# Altium schematic sheet MCU.SchDoc: MCU
size A3; Date: April '16; Organization: Fachhochschule Aachen; Address1: Fachbereich Elektrotechnik und Informationstechnik; Address2: Eupenerstraße 70; Address3: 52066 Aachen; DocumentNumber: 1; Revision: 01.00; SheetNumber: 1; SheetTotal: 2; ModifiedDate: -> Datum
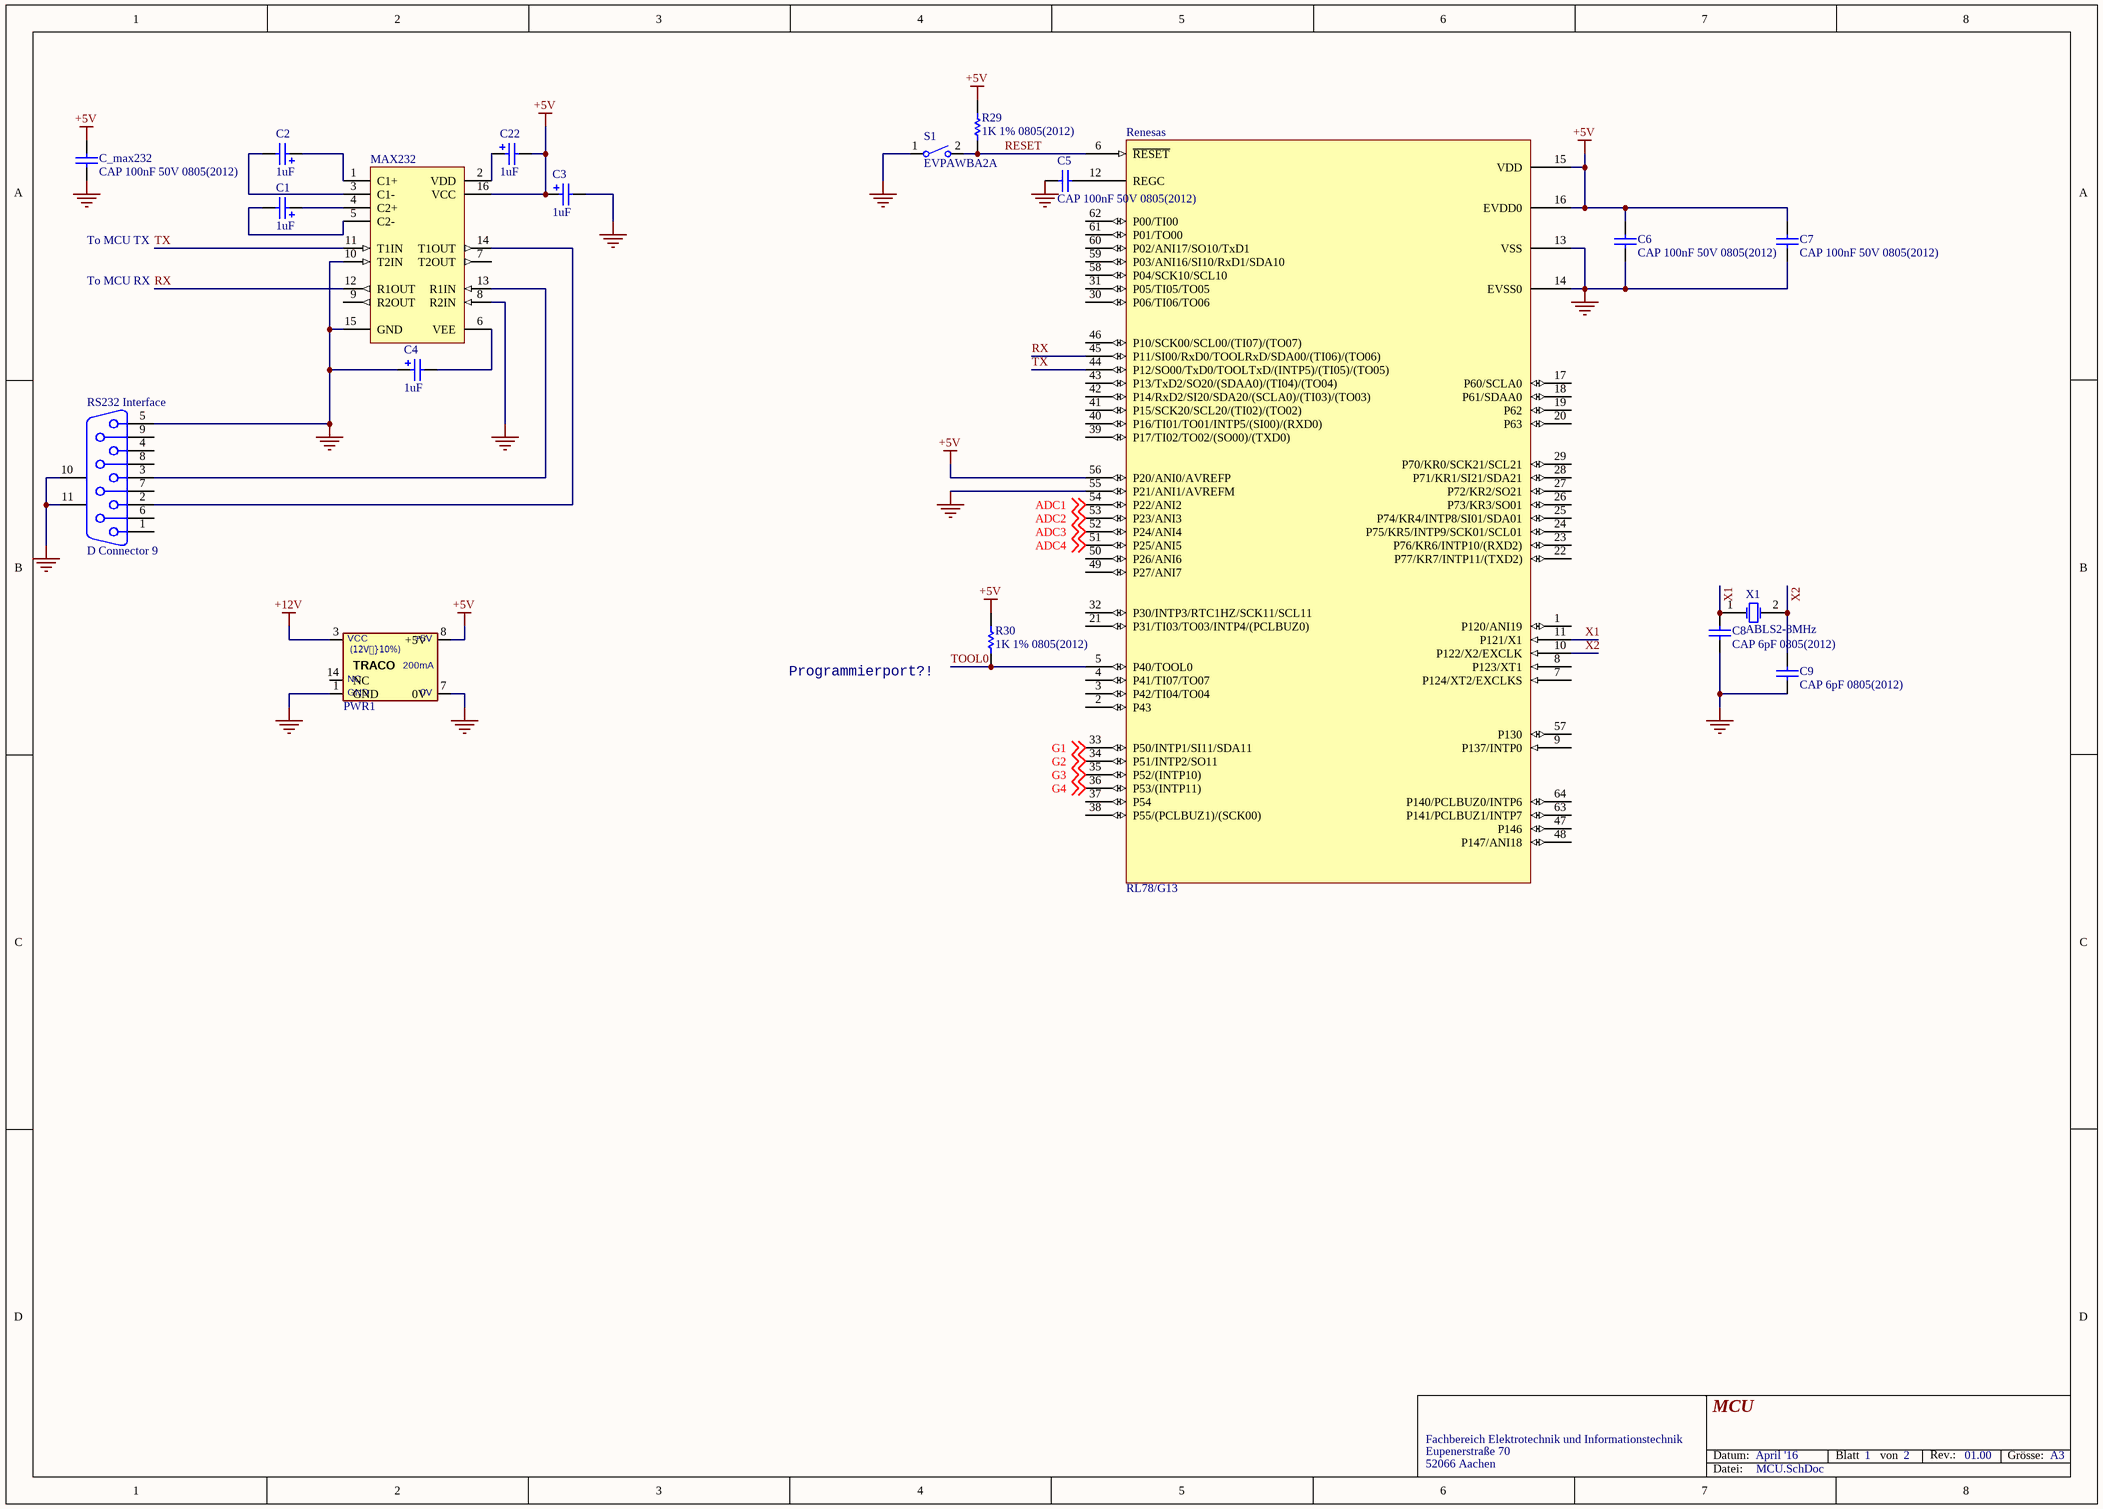
[diagram p0: MCU.SchDoc]

## Parts
C1  value 1uF  [CC2012-0805]  (hidden comment: Cap Pol3)
C2  value 1uF  [CC2012-0805]  (hidden comment: Cap Pol3)
C3  value 1uF  [CC2012-0805]  (hidden comment: Cap Pol3)
C4  value 1uF  [CC2012-0805]  (hidden comment: Cap Pol3)
C5  CAP 100nF 50V 0805(2012)  [CAPC0805(2012)145_M]
C6  CAP 100nF 50V 0805(2012)  [CAPC0805(2012)145_M]
C7  CAP 100nF 50V 0805(2012)  [CAPC0805(2012)145_M]
C8  CAP 6pF 0805(2012)  [CAPC0805(2012)145_M]
C9  CAP 6pF 0805(2012)  [CAPC0805(2012)145_M]
C22  value 1uF  [CC2012-0805]  (hidden comment: Cap Pol3)
C_max232  CAP 100nF 50V 0805(2012)  [CAPC0805(2012)145_M]
MAX232  MAX232CSE  [NSO16]  (value not drawn)
PWR1  TES1-1211  [TES14]  (value not drawn)
R29  1K 1% 0805(2012)  [RESC0805(2012)_M]
R30  1K 1% 0805(2012)  [RESC0805(2012)_M]
Renesas  RL78/G13  [R5F100LEAFA - duplicate]
RS232_Interface  D Connector 9  [DSUB1.385-2H9]
S1  EVPAWBA2A  [PNSC-EVPAW_V]
X1  ABLS2-8MHz  [ABRA-ABLS2-2_V]

## Nets
+5V: C3.1 C6.2 C7.2 C22.2 C_max232.2 MAX232.16(VCC) PWR1.8(+5V) R29.1 R30.1 Renesas.15(VDD) Renesas.16(EVDD0) Renesas.56(P20/ANI0/AVREFP)
+12V: PWR1.3(VCC)
GND: C3.2 C4.1 C5.2 C6.1 C7.1 C8.1 C9.1 C_max232.1 MAX232.8(R2IN) MAX232.10(T2IN) MAX232.15(GND) PWR1.1(GND) PWR1.7(0V) Renesas.13(VSS) Renesas.14(EVSS0) Renesas.55(P21/ANI1/AVREFM) RS232_Interface.5 RS232_Interface.10(MH1) RS232_Interface.11(MH2) S1.1(A1)
ADC1: Renesas.54(P22/ANI2) ; off-sheet ADC1
ADC2: Renesas.53(P23/ANI3) ; off-sheet ADC2
ADC3: Renesas.52(P24/ANI4) ; off-sheet ADC3
ADC4: Renesas.51(P25/ANI5) ; off-sheet ADC4
G1: Renesas.33(P50/INTP1/SI11/SDA11) ; off-sheet G1
G2: Renesas.34(P51/INTP2/SO11) ; off-sheet G2
G3: Renesas.35(P52/(INTP10)) ; off-sheet G3
G4: Renesas.36(P53/(INTP11)) ; off-sheet G4
RESET: R29.2 Renesas.6(~{RESET}) S1.2(B1)
RX: MAX232.12(R1OUT) Renesas.45(P11/SI00/RxD0/TOOLRxD/SDA00/(TI06)/(TO06))
TOOL0: R30.2 Renesas.5(P40/TOOL0)
TX: MAX232.11(T1IN) Renesas.44(P12/SO00/TxD0/TOOLTxD/(INTP5)/(TI05)/(TO05))
X1: C8.2 Renesas.11(P121/X1) X1.1(X1)
X2: C9.2 Renesas.10(P122/X2/EXCLK) X1.2(X2)
NetC1_1: C1.1 MAX232.4(C2+)
NetC1_2: C1.2 MAX232.5(C2-)
NetC2_1: C2.1 MAX232.1(C1+)
NetC2_2: C2.2 MAX232.3(C1-)
NetC4_2: C4.2 MAX232.6(VEE)
NetC5_1: C5.1 Renesas.12(REGC)
NetC22_1: C22.1 MAX232.2(VDD)
NetMAX232_13: MAX232.13(R1IN) RS232_Interface.3
NetMAX232_14: MAX232.14(T1OUT) RS232_Interface.2

Not connected (* = marked no-connect by the designer): MAX232 7(T2OUT) 9(R2OUT); PWR1 14(NC); Renesas 1(P120/ANI19) 2(P43) 3(P42/TI04/TO04) 4(P41/TI07/TO07) 7(P124/XT2/EXCLKS) 8(P123/XT1) 9(P137/INTP0) 17(P60/SCLA0) 18(P61/SDAA0) 19(P62) 20(P63) 21(P31/TI03/TO03/INTP4/(PCLBUZ0)) 22(P77/KR7/INTP11/(TXD2)) 23(P76/KR6/INTP10/(RXD2)) 24(P75/KR5/INTP9/SCK01/SCL01) 25(P74/KR4/INTP8/SI01/SDA01) 26(P73/KR3/SO01) 27(P72/KR2/SO21) 28(P71/KR1/SI21/SDA21) 29(P70/KR0/SCK21/SCL21) 30(P06/TI06/TO06) 31(P05/TI05/TO05) 32(P30/INTP3/RTC1HZ/SCK11/SCL11) 37(P54) 38(P55/(PCLBUZ1)/(SCK00)) 39(P17/TI02/TO02/(SO00)/(TXD0)) 40(P16/TI01/TO01/INTP5/(SI00)/(RXD0)) 41(P15/SCK20/SCL20/(TI02)/(TO02)) 42(P14/RxD2/SI20/SDA20/(SCLA0)/(TI03)/(TO03)) 43(P13/TxD2/SO20/(SDAA0)/(TI04)/(TO04)) 46(P10/SCK00/SCL00/(TI07)/(TO07)) 47(P146) 48(P147/ANI18) 49(P27/ANI7) 50(P26/ANI6) 57(P130) 58(P04/SCK10/SCL10) 59(P03/ANI16/SI10/RxD1/SDA10) 60(P02/ANI17/SO10/TxD1) 61(P01/TO00) 62(P00/TI00) 63(P141/PCLBUZ1/INTP7) 64(P140/PCLBUZ0/INTP6); RS232_Interface 1 4 6 7 8 9

## Notes on the sheet
- To MCU TX
- To MCU RX
- Programmierport?!
- Datum:
- Blatt
- von
- Rev.:
- Grösse:
- A3
- Datei:
- (in symbol TES1-1211) (12V}10%); 200mA

## Library data of the parts
C1-C4 C22 = Cap Pol3: Polarized Capacitor (Surface Mount); Published: 8-Jun-2000; Revision: July-2002: Re-released for DXP Platform.; Publisher: Altium Limited
C5-C9 C_max232 = CMP-1036-04419-1: CAP 100nF 50V ±10% 0805 (2012 Metric) Thickness 1.45mm SMD; Tolerance: Â±10%; Case-EIA: 0805; Case-Metric: 2012; Rated Voltage: 50 V; Technology: SMT; Max Thickness: 1.45 mm; Value: 100nF
MAX232 = MAX232CSE: +5V Powered, Multi-Channel RS-232 Driver/Receiver; Code - JEDEC: MS-012-AC; Code - IPC: SO16; Published: 16-Jan-2001; Revision: 17-Jul-2002: Re-released for DXP Platform.; Package Reference: NSO16; Publisher: Altium Limited
PWR1 = TES1-1211: Input=12V}10% Output=5V 200mA 1W 1500VDC Isolation SMD14 RoHS; Manufactuer: TRACO; Manufactuer P/N: TES1-1211; HelpURL: http://www.tracopower.com/
R29 R30 = CMP-1013-00623-1: 10K 0.125W 1% 0805 (2012 Metric)  SMD; Value: 10000.00 Ohm; Case-Metric: 2012; Case-EIA: 0805; Tolerance: 1 %; Power: 0.125 W; Technology: SMT
RS232_Interface = D Connector 9: Receptacle Assembly, 9 Position, Right Angle; Package Information: Latest Revision: O; Positions: 9; Published: 15-Jun-2001; Revision: 17-Jul-2002: Re-released for DXP Platform.; Datasheet: (1-Sep-1999); Package Reference: 788750; Publisher: Altium Limited; Orientation: Right Angle; Gender: Receptacle
S1 = CMP-1339-00001-1: Light Touch Switch, 0.02 A at 15 VDC, 500 mOhm, -40 to 85 degC, 2-Pin 3 x 2 x 0.6 mm SMD, RoHS, Tape and Reel; Manufacturer: Panasonic; Contact Rating@2 VDC: 10 uA; Contact Resistance: 500 mOhm Max.; Contact Rating@15 VDC: 0.02 A; Insulation Resistance@100 VDC: 50 MOhm Min.; Bouncing: 10 ms Max.; RoHS: TRUE; Temperature Range: -40 to 85 degC; ComponentLink1URL: http://na.industrial.panasonic.com/; ComponentLink2URL: http://industrial.panasonic.com/www-data/pdf/ATK0000/ATK0000CE40.pdf; ComponentLink2Description: Datasheet; ComponentLink1Description: Manufacturer URL; ComponentLink3URL: http://industrial.panasonic.com/www-data/pdf/ATK0000/ATK0000CE40.pdf; PackageDescription: 2-Pin Surface Mount Device, Body 3 x 2 mm, Pitch 3.25 mm; DatasheetVersion: May-14; Mounting Technology: Surface Mount; Packing: Tape and Reel; PartNumber: EVPAWBA2A; ComponentLink3Description: Package Specification
X1 = CMP-0277-00002-1: Low Profile Surface Mount Microprocessor Crystal, 4.096 MHz +/-30 ppm, 180 Ohm, -40 to 85 degC, 2-Pin 11.4 x 4.7 x 3.3 mm SMD, RoHS, Tape and Reel; Manufacturer: Abracon; PartNumber: ABLS2-4.096MHZ-D4Y-T; Operation Mode: Fundamental or 3rd Overtone; Shunt Capacitance: 7 pF Max.; ESR: 180 Ohm; Load Capacitance: 18 pF; Mounting Technology: Surface Mount; PackageDescription: 2-Pin SMD, Body 11.4 x 4.7 mm, Height 3.3 mm; ComponentLink1URL: http://www.abracon.com/; Freq. Stability: +/- 30 ppm; ComponentLink2Description: Datasheet; Operating Temp. Range: -40 to 85 degC; Packing: Tape and Reel; RoHS: TRUE; PackageReference: ABLS2-2; DatasheetVersion: Rev. 03.31.11; Freq. Tolerance: +/- 30 ppm; Frequency: 4.096 MHz; ComponentLink2URL: http://www.abracon.com/Resonators/ABLS2.pdf; ComponentLink1Description: Manufacturer URL